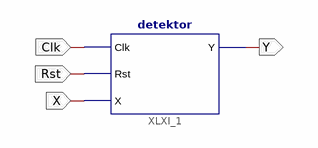
[diagram p0: schematic sheet 1]
// Xilinx ISE schematic detektor_schemat.sch (xc9500xl) as structural Verilog: 1 symbols, 4 ports
module detektor_schemat (
  input  Clk,
  input  Rst,
  input  X,
  output Y
);

  detektor XLXI_1 (.Clk(Clk), .Rst(Rst), .X(X), .Y(Y));
endmodule
